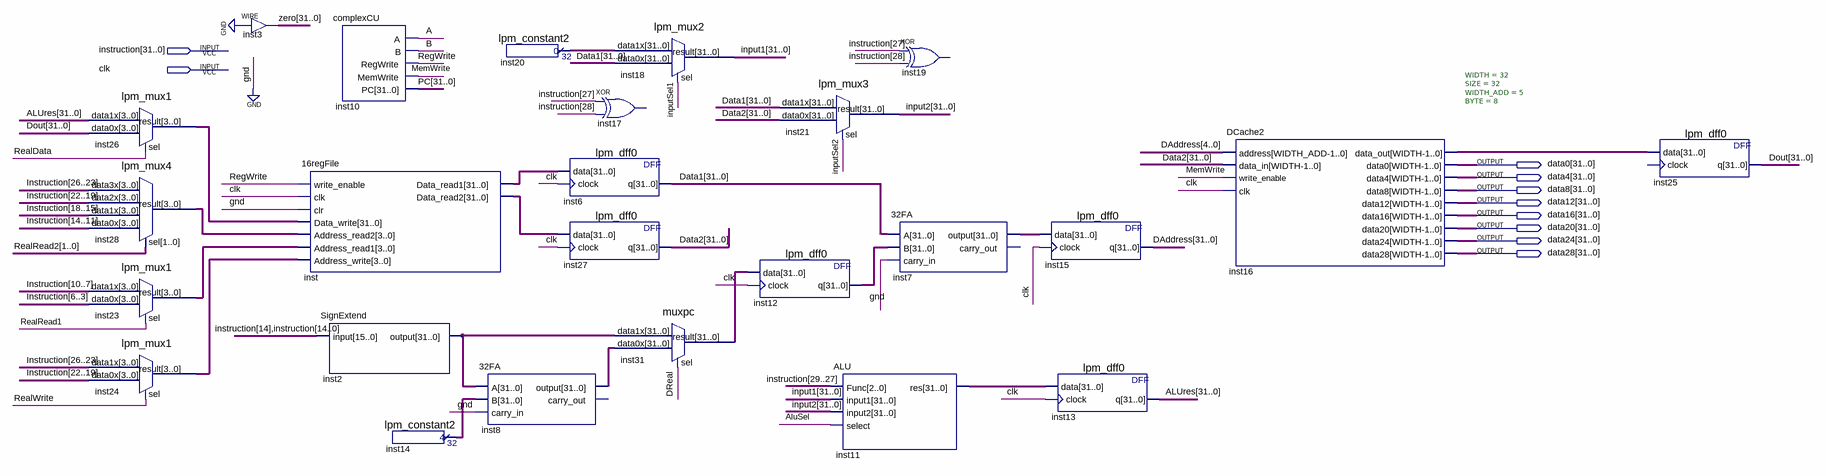
[diagram p0: schematic sheet]
// Quartus schematic complexCPU.bdf as structural Verilog: 25 symbols, 10 pins
module complexCPU (
  input  [31:0] instruction,
  input  clk,
  output [31:0] data0,
  output [31:0] data4,
  output [31:0] data8,
  output [31:0] data12,
  output [31:0] data16,
  output [31:0] data20,
  output [31:0] data24,
  output [31:0] data28
);

  wire A, AluSel, B, DReal, inputSel1, inputSel2, MemWrite, RealData, RealRead1, RealWrite, RegWrite;
  wire [1:0] RealRead2;
  wire [3:0] inst23_result, inst24_result, inst28_result;
  wire [31:0] ALUres, DAddress, Data1, Data2, Dout, input1, input2, inst2_output, inst7_output, inst8_output,
       inst11_res, inst12_q, inst14_result, inst16_data_out, inst20_result, inst26_result, inst31_result,
       inst_data_read1, inst_data_read2, PC, zero;

  lpm_mux1 inst26 (.data1x(ALUres), .data0x(Dout), .sel(RealData), .result(inst26_result));
  lpm_mux4 inst28 (
    .data3x(instruction[26:23]), .data2x(instruction[22:19]), .data1x(instruction[18:15]),
    .data0x(instruction[14:11]), .sel(RealRead2), .result(inst28_result));
  lpm_mux1 inst23 (.data1x(instruction[10:7]), .data0x(instruction[6:3]), .sel(RealRead1), .result(inst23_result));
  lpm_mux1 inst24 (.data1x(instruction[26:23]), .data0x(instruction[22:19]), .sel(RealWrite), .result(inst24_result));
  assign zero = {32{1'b0}};  // WIRE inst3
  \16regFile  inst (
    .write_enable(RegWrite), .clk(clk), .clr(1'b0), .Data_write(inst26_result),
    .Address_read2(inst28_result), .Address_read1(inst23_result), .Address_write(inst24_result),
    .Data_read1(inst_data_read1), .Data_read2(inst_data_read2));
  SignExtend inst2 (.\input ({{2{instruction[14]}}, instruction[13:0]}), .\output (inst2_output));
  complexCU inst10 (.A(A), .B(B), .RegWrite(RegWrite), .MemWrite(MemWrite), .PC(PC));
  lpm_constant2 inst14 (.result(inst14_result));
  \32FA  inst8 (.A(inst2_output), .B(inst14_result), .carry_in(1'b0), .\output (inst8_output));  // open: carry_out
  lpm_constant2 inst20 (.result(inst20_result));
  lpm_dff0 inst6 (.data(inst_data_read1), .clock(clk), .q(Data1));
  lpm_dff0 inst27 (.data(inst_data_read2), .clock(clk), .q(Data2));
  lpm_mux2 inst18 (.data1x(inst20_result), .data0x(Data1), .sel(inputSel1), .result(input1));
  // XOR inst17 has open pins: IN1=instruction[27], IN2=instruction[28], OUT=open
  muxpc inst31 (.data1x(inst2_output), .data0x(inst8_output), .sel(DReal), .result(inst31_result));
  lpm_mux3 inst21 (.data1x(Data1), .data0x(Data2), .sel(inputSel2), .result(input2));
  lpm_dff0 inst12 (.data(inst31_result), .clock(clk), .q(inst12_q));
  ALU inst11 (.Func(instruction[29:27]), .input1(input1), .input2(input2), .select(AluSel), .res(inst11_res));
  // XOR inst19 has open pins: IN1=instruction[27], IN2=instruction[28], OUT=open
  \32FA  inst7 (.A(Data1), .B(inst12_q), .carry_in(1'b0), .\output (inst7_output));  // open: carry_out
  lpm_dff0 inst15 (.data(inst7_output), .clock(clk), .q(DAddress));
  lpm_dff0 inst13 (.data(inst11_res), .clock(clk), .q(ALUres));
  DCache2 #(.WIDTH(32), .SIZE(32), .WIDTH_ADD(5), .BYTE(8)) inst16 (
    .address(DAddress[4:0]), .data_in(Data2), .write_enable(MemWrite), .clk(clk), .data_out(inst16_data_out),
    .data0(data0), .data4(data4), .data8(data8), .data12(data12), .data16(data16), .data20(data20),
    .data24(data24), .data28(data28));
  lpm_dff0 inst25 (.data(inst16_data_out), .q(Dout));  // open: clock
endmodule
